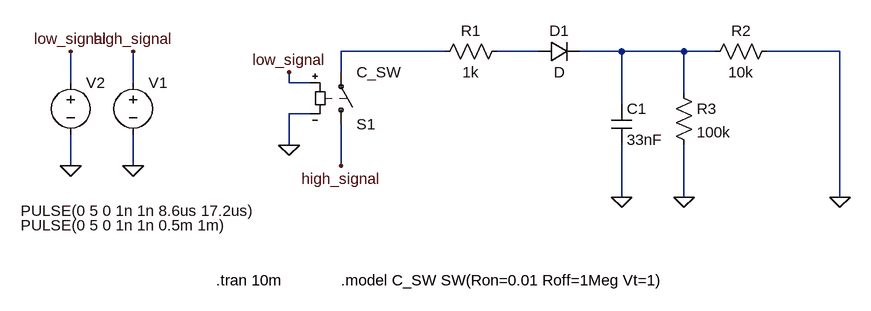
[diagram p0: schematic LPF.asc]
LPF.asc, the LTspice schematic file:
Version 4
SHEET 1 1032 680
WIRE 304 -48 144 -48
WIRE 448 -48 384 -48
WIRE 576 -48 512 -48
WIRE 672 -48 576 -48
WIRE 720 -48 672 -48
WIRE 912 -48 800 -48
WIRE 144 -16 144 -48
WIRE -272 0 -272 -48
WIRE -176 0 -176 -48
WIRE 64 0 64 -16
WIRE 96 0 64 0
WIRE 672 16 672 -48
WIRE 576 32 576 -48
WIRE 96 48 64 48
WIRE 64 96 64 48
WIRE -272 128 -272 80
WIRE -176 128 -176 80
WIRE 144 128 144 64
WIRE 576 176 576 96
WIRE 672 176 672 96
WIRE 912 176 912 -48
FLAG -176 128 0
FLAG 576 176 0
FLAG 912 176 0
FLAG -176 -48 high_signal
FLAG 144 128 high_signal
FLAG -272 128 0
FLAG -272 -48 low_signal
FLAG 64 -16 low_signal
FLAG 64 96 0
FLAG 672 176 0
SYMBOL voltage -176 -16 R0
WINDOW 3 -173 213 Left 2
WINDOW 123 0 0 Left 0
WINDOW 39 0 0 Left 0
SYMATTR Value PULSE(0 5 0 1n 1n 8.6us 17.2us)
SYMATTR InstName V1
SYMBOL res 400 -64 R90
WINDOW 0 0 56 VBottom 2
WINDOW 3 32 56 VTop 2
SYMATTR InstName R1
SYMATTR Value 1k
SYMBOL cap 560 32 R0
SYMATTR InstName C1
SYMATTR Value 33nF
SYMBOL res 816 -64 R90
WINDOW 0 0 56 VBottom 2
WINDOW 3 32 56 VTop 2
SYMATTR InstName R2
SYMATTR Value 10k
SYMBOL sw 144 80 M180
SYMATTR InstName S1
SYMATTR Value C_SW
SYMBOL voltage -272 -16 R0
WINDOW 3 -77 235 Left 2
WINDOW 123 0 0 Left 0
WINDOW 39 0 0 Left 0
SYMATTR Value PULSE(0 5 0 1n 1n 0.5m 1m)
SYMATTR InstName V2
SYMBOL diode 448 -32 R270
WINDOW 0 32 32 VTop 2
WINDOW 3 0 32 VBottom 2
SYMATTR InstName D1
SYMBOL res 656 0 R0
SYMATTR InstName R3
SYMATTR Value 100k
TEXT -48 304 Left 2 !.tran 10m
TEXT 144 304 Left 2 !.model C_SW SW(Ron=0.01 Roff=1Meg Vt=1)

The netlist it stands for:
* LPF.asc
V1 high_signal 0 PULSE(0 5 0 1n 1n 8.6us 17.2us)
R1 N002 N001 1k
C1 N003 0 33nF
R2 0 N003 10k
S1 high_signal N001 low_signal 0 C_SW
V2 low_signal 0 PULSE(0 5 0 1n 1n 0.5m 1m)
D1 N002 N003 D
R3 N003 0 100k
.model D D
.lib standard.dio
.tran 10m
.model C_SW SW(Ron=0.01 Roff=1Meg Vt=1)
.backanno
.end